# Altium schematic sheet 电子脚铐便携式主控板-YL-800TS.SchDoc
size A4
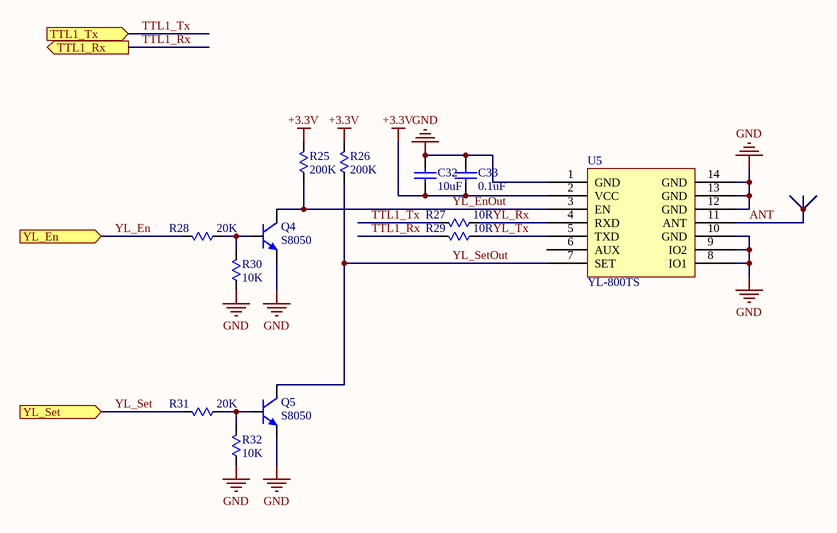
[diagram p0: 电子脚铐便携式主控板-YL-800TS.SchDoc]

## Parts
C32  10uF  [C0603]
C33  0.1uF  [C0603]
Q4  S8050  [SOT-23]
Q5  S8050  [SOT-23]
R25  200K  [R0603]
R26  200K  [R0603]
R27  value 10R  [R0603]  (hidden comment: 200K)
R28  value 20K  [R0603]  (hidden comment: 200K)
R29  value 10R  [R0603]  (hidden comment: 200K)
R30  10K  [R0603]
R31  value 20K  [R0603]  (hidden comment: 200K)
R32  10K  [R0603]
U5  YL-800TS  [YL-800TS]

## Ports
TTL1_Rx (out), TTL1_Tx (in), YL_En (in), YL_Set (in)

## Nets
+3.3V: C32.1 C33.1 R25.2 R26.2 U5.2(VCC)
GND: C32.2 C33.2 Q4.2(e) Q5.2(e) R30.1 R32.1 U5.1(GND) U5.8(IO1) U5.9(IO2) U5.10(GND) U5.12(GND) U5.13(GND) U5.14(GND)
ANT: U5.11(ANT)
TTL1_Rx: R29.2 ; port TTL1_Rx
TTL1_Tx: R27.2 ; port TTL1_Tx
YL_En: R28.2 ; port YL_En
YL_EnOut: Q4.3(c) R25.1 U5.3(EN)
YL_Rx: R27.1 U5.4(RXD)
YL_Set: R31.2 ; port YL_Set
YL_SetOut: Q5.3(c) R26.1 U5.7(SET)
YL_Tx: R29.1 U5.5(TXD)
NetQ4_1: Q4.1(b) R28.1 R30.2
NetQ5_1: Q5.1(b) R31.1 R32.2

Not connected (* = marked no-connect by the designer): U5 6(AUX)

## Notes on the sheet
- 文件名:
- 审核:
- 制图人:
- 孟浩
- 校对:
- 图号:
- 批准:
- 日期:

## Library data of the parts
C32 C33 = CAP: Published: 8-Jun-2000; LatestRevisionDate: 17-Jul-2002; LatestRevisionNote: Re-released for DXP Platform.; PackageReference: RAD-0.3; Publisher: Altium Limited
  C32: Value: 10uF
  C33: Value: 0.1uF
Q4 Q5 = S8050: NPN triode, 0.5A Max
R25-R32 = RES: Resistor; Published: 8-Jun-2000; LatestRevisionDate: 17-Jul-2002; LatestRevisionNote: Re-released for DXP Platform.; PackageReference: AXIAL-0.3; Publisher: Altium Limited
  R25 R26: Value: 200K
  R30 R32: Value: 10K